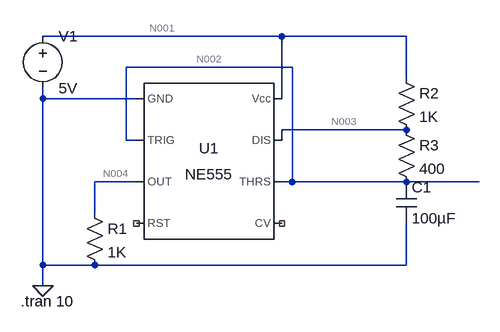
[diagram p0: schematic Draft2.asc]
Draft2.asc, the LTspice schematic file:
Version 4
SHEET 1 880 680
WIRE 128 -192 -240 -192
WIRE 320 -192 128 -192
WIRE 144 -144 -112 -144
WIRE 320 -128 320 -192
WIRE -240 -96 -240 -112
WIRE -96 -96 -240 -96
WIRE 128 -96 128 -192
WIRE 320 -48 128 -48
WIRE -112 -32 -112 -144
WIRE -96 -32 -112 -32
WIRE 128 -32 128 -48
WIRE -96 32 -160 32
WIRE 144 32 144 -144
WIRE 144 32 128 32
WIRE 320 32 144 32
WIRE 432 32 320 32
WIRE -160 80 -160 32
WIRE -240 160 -240 -96
WIRE -160 160 -240 160
WIRE 320 160 320 96
WIRE 320 160 -160 160
WIRE -240 192 -240 160
FLAG -240 192 0
SYMBOL Misc\\NE555 16 0 R0
SYMATTR InstName U1
SYMBOL voltage -240 -208 R0
WINDOW 123 0 0 Left 0
WINDOW 39 0 0 Left 0
SYMATTR InstName V1
SYMATTR Value 5V
SYMBOL cap 304 32 R0
SYMATTR InstName C1
SYMATTR Value 100µF
SYMBOL res -176 64 R0
SYMATTR InstName R1
SYMATTR Value 1K
SYMBOL res 304 -64 R0
SYMATTR InstName R3
SYMATTR Value 400
SYMBOL res 304 -144 R0
SYMATTR InstName R2
SYMATTR Value 1K
TEXT -274 216 Left 2 !.tran 10

The netlist it stands for:
* Draft2.asc
XU1 0 N002 N004 NC_01 NC_02 N002 N003 N001 NE555  ; pins GND TRIG OUT RST CV THRS DIS Vcc
V1 N001 0 5V
C1 N002 0 100µF
R1 N004 0 1K
R3 N003 N002 400
R2 N001 N003 1K
.tran 10
.lib NE555.sub
.backanno
.end

* Results of the author's LTspice run, read from the files saved beside the schematic
* Operating Point, zero values left out:
*   V(n002) = 5 V
*   V(n001) = 5 V
*   V(n003) = 5 V
*   V(n004) = 4.97 V
*   I(R2) = 16.67 nA
*   I(R3) = 10 nA
*   I(R1) = 4.97 mA
*   I(V1) = -6.58 mA
*   Ix(u1:1) = -1.61 mA
*   Ix(u1:2) = 5 nA
*   Ix(u1:3) = -4.97 mA
*   Ix(u1:6) = 5 nA
*   Ix(u1:7) = 6.672 nA
*   Ix(u1:8) = 6.58 mA
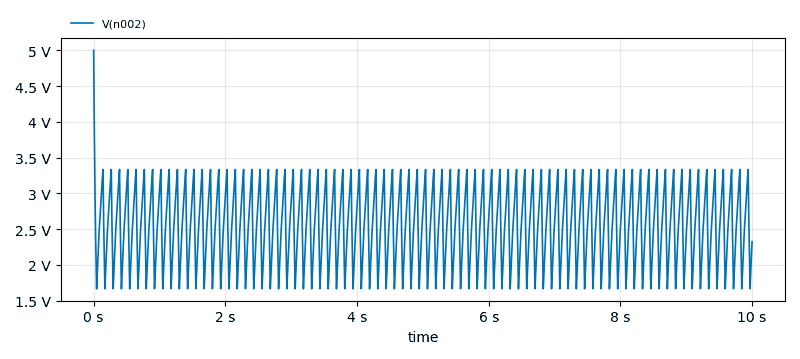
[diagram p1: Transient Analysis of Draft2.asc, plotted from the saved traces]
* Transient Analysis, 1 run:
*   V(n002): min 1.666 V, max 5 V, average 2.543 V, rms 2.603 V, last 2.325 V